# Altium schematic sheet REF_VOLTAGE_RELAY_DRIVER.SchDoc
size A; SheetNumber: 3; SheetTotal: 6
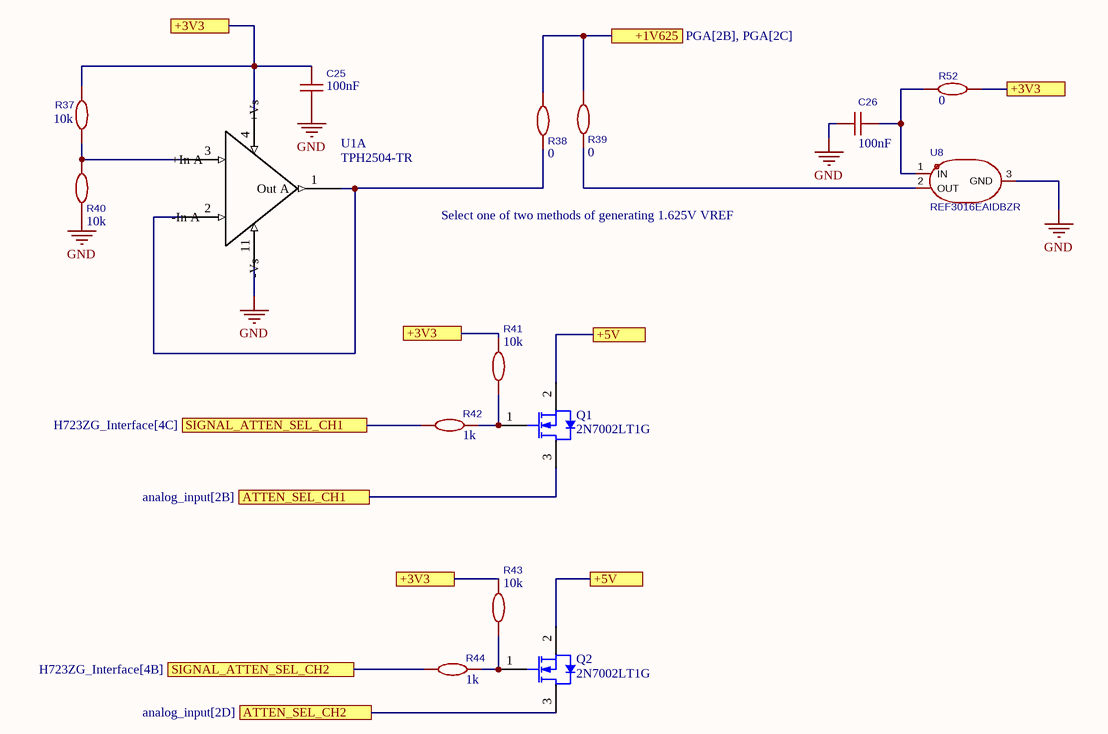
[diagram p0: REF_VOLTAGE_RELAY_DRIVER.SchDoc]

## Parts
C25  value 100nF  [C0805]  (hidden comment: 0805CG6R0C500NT_C67560)
C26  value 100nF  [C0805]  (hidden comment: 0805CG6R0C500NT_C67560)
Q1  2N7002LT1G  [ONSC-SOT-23-3-318-08_V]
Q2  2N7002LT1G  [ONSC-SOT-23-3-318-08_V]
R37  value 10k  [R0805]  (hidden comment: 0805W8F0000T5E_C17477)
R38  value 0  [R0805]  (hidden comment: 0805W8F0000T5E_C17477)
R39  value 0  [R0805]  (hidden comment: 0805W8F0000T5E_C17477)
R40  value 10k  [R0805]  (hidden comment: 0805W8F0000T5E_C17477)
R41  value 10k  [R0805]  (hidden comment: 0805W8F0000T5E_C17477)
R42  value 1k  [R0805]  (hidden comment: 0805W8F0000T5E_C17477)
R43  value 10k  [R0805]  (hidden comment: 0805W8F0000T5E_C17477)
R44  value 1k  [R0805]  (hidden comment: 0805W8F0000T5E_C17477)
R52  value 0  [R0805]  (hidden comment: 0805W8F0000T5E_C17477)
U1  TPH2504-TR  [TSOP65P640X120-14N]  (part A of 4)
U8  REF3016EAIDBZR  [SOT-23-3_L3.0-W1.7-P0.95-LS2.9-BR]

## Ports
+1V625 (see PGA[2B], PGA[2C]), +3V3 (see H723ZG_Interface[1A], PGA[2A], PGA[2B], PGA[4A], PGA[4C], REF_VOLTAGE_RELAY_DRIVER[1A], REF_VOLTAGE_RELAY_DRIVER[2B], REF_VOLTAGE_RELAY_DRIVER[2C], Trigger[1C], Trigger[3A]), +3V3 (see H723ZG_Interface[1A], PGA[2A], PGA[2B], PGA[4A], PGA[4C], REF_VOLTAGE_RELAY_DRIVER[1A], REF_VOLTAGE_RELAY_DRIVER[2B], REF_VOLTAGE_RELAY_DRIVER[4A], Trigger[1C], Trigger[3A]), +3V3 (see H723ZG_Interface[1A], PGA[2A], PGA[2B], PGA[4A], PGA[4C], REF_VOLTAGE_RELAY_DRIVER[1A], REF_VOLTAGE_RELAY_DRIVER[2C], REF_VOLTAGE_RELAY_DRIVER[4A], Trigger[1C], Trigger[3A]), +3V3 (see H723ZG_Interface[1A], PGA[2A], PGA[2B], PGA[4A], PGA[4C], REF_VOLTAGE_RELAY_DRIVER[2B], REF_VOLTAGE_RELAY_DRIVER[2C], REF_VOLTAGE_RELAY_DRIVER[4A], Trigger[1C], Trigger[3A]), +5V (see H723ZG_Interface[1A], PGA[3A], PGA[3C], REF_VOLTAGE_RELAY_DRIVER[2C], Trigger[2B], Trigger[4A]), +5V (see H723ZG_Interface[1A], PGA[3A], PGA[3C], REF_VOLTAGE_RELAY_DRIVER[3B], Trigger[2B], Trigger[4A]), ATTEN_SEL_CH1 (see analog_input[2B]), ATTEN_SEL_CH2 (see analog_input[2D]), SIGNAL_ATTEN_SEL_CH1 (see H723ZG_Interface[4C]), SIGNAL_ATTEN_SEL_CH2 (see H723ZG_Interface[4B])

## Nets
GND: C25.2 C26.1 R40.2 U1.11(-Vs) U8.3(GND)
+1V625: R38.1 R39.1 ; port +1V625
+3V3: C25.1 R37.1 R41.2 R43.2 R52.2 U1.4(+Vs) ; port +3V3
+5V: Q1.2(S) Q2.2(S) ; port +5V
ATTEN_SEL_CH1: Q1.3(D) ; port ATTEN_SEL_CH1
ATTEN_SEL_CH2: Q2.3(D) ; port ATTEN_SEL_CH2
SIGNAL_ATTEN_SEL_CH1: R42.1 ; port SIGNAL_ATTEN_SEL_CH1
SIGNAL_ATTEN_SEL_CH2: R44.1 ; port SIGNAL_ATTEN_SEL_CH2
NetC26_2: C26.2 R52.1 U8.1(IN)
NetQ1_1: Q1.1(G) R41.1 R42.2
NetQ2_1: Q2.1(G) R43.1 R44.2
NetR37_2: R37.2 R40.1 U1.3(+In_A)
NetR38_2: R38.2 U1.1(Out_A) U1.2(-In_A)
NetR39_2: R39.2 U8.2(OUT)

## Notes on the sheet
- Select one of two methods of generating 1.625V VREF

## Library data of the parts
C25 C26 = CMP-015-000003-2: Capacitance:100nF Tolerance:±5% Tolerance:±5% Voltage Rating:50V Temperature Coefficient:X7R; Manufacturer: YAGEO(国巨); AddInBom: yes; Device: CC0805JRX7R9BB104; ModelId: 8c88e81f49c6409b980720ec8953afb6聨0819f05c4eef4c71ace90d822a990e87; ModelName: C0805_L2.0-W1.3-H1.3; ModelTransform: 78.74,51.181,0,0,0,0,0,0.0005,0; Temperature Coefficient: X7R; Tolerance: 5%; Voltage Rating: 50V; ConvertToPcb: yes; Datasheet: https://item.szlcsc.com/datasheet/CC0805JRX7R9BB104/112720.html; Design Item ID: CC0805JRX7R9BB104; FootprintName: C0805; JLCPCB Part Class: Extended Part; LCSC Part Name: 100nF ±5% 50V; Source: P1.SCHLIB; Supplier Footprint: 0805; Symbol: CC0805JRX7R9BB104; Manufacturer Part Number: CC0805JRX7R9BB104; Supplier Part Number: C111492
Q1 Q2 = CMP-1058-00781-1: Small Signal MOSFET, 60 V, 115 mA, N-Channel, 3-Pin SOT-23, Pb-Free, Tape and Reel; Manufacturer: On Semiconductor; Channel Polarity: N Channel; V(BR)DSS Min (V): 60; ID Max (A): 0.115; VGS Max (V): 20; Configuration: Single; VGS(th) Max (V): 2.5; ComponentLink1URL: http://www.onsemi.com/; ComponentLink3Description: Package Specification; ComponentLink3URL: http://www.onsemi.cn/pub_link/Collateral/318-08.PDF; PackageReference: SOT-23-3-318-08; RoHS: Pb-Free; ComponentLink2URL: http://www.onsemi.com/pub_link/Collateral/2N7002L-D.PDF; ComponentLink1Description: Manufacturer URL; Package Type: SOT-23-3; Packing: Tape and Reel; PartNumber: 2N7002LT1G; DatasheetVersion: Rev. 7; Mounting Technology: Surface Mount; ComponentLink2Description: Datasheet; PackageDescription: 3-Pin Small Outline Transistor, Body 2.92 x 1.3 mm, Pitch 0.95 mm; PackageVersion: Rev. AP, 11/2009
R37 R40 R41 R43 = CMP-016-000002-1: Type:Thick Film Resistor Resistance:10kΩ Tolerance:±1% Tolerance:±1% Power(Watts):125mW Voltage-Supply(Max):150V Temperature Coefficient:±100ppm/℃ Temperature Coefficient:±100ppm/℃ Operating Temperature:-55℃~+155℃ Operating Temperature:-55℃~+155℃; Manufacturer: UNI-ROYAL(厚声); AddInBom: yes; Device: 0805W8F1002T5E; ModelId: b83c7c5430874b8eb2319a65d9433429聨0819f05c4eef4c71ace90d822a990e87; ModelName: R0805_L2.0-W1.3-H0.6; ModelTransform: 78.74,51.181,0,0,0,0,0,-0.0005,0; Power(Watts): 125mW; Tolerance: 1%; Voltage-Supply(Max): 150V; ConvertToPcb: yes; Datasheet: https://item.szlcsc.com/datasheet/0805W8F1002T5E/18102.html; Design Item ID: 0805W8F1002T5E; FootprintName: R0805; JLCPCB Part Class: Basic Part; LCSC Part Name: 10kΩ ±1% 125mW 厚膜电阻; Operating Temperature: -55℃~+155℃; Source: P1.SCHLIB; Supplier Footprint: 0805; Symbol: 0805W8F1002T5E; Temperature Coefficient: ±100ppm/℃; Type: Thick Film Resistor; Manufacturer Part Number: 0805W8F1002T5E; Supplier Part Number: C17414
R38 R39 R52 = CMP-016-000018-1: Type:Thick Film Resistor Resistance:0Ω Tolerance:±1% Tolerance:±1% Power(Watts):125mW Voltage-Supply(Max):150V Temperature Coefficient:±800ppm/℃ Temperature Coefficient:±800ppm/℃ Operating Temperature:-55℃~+155℃ Operating Temperature:-55℃~+155℃; Manufacturer: UNI-ROYAL(厚声); AddInBom: yes; ModelId: b83c7c5430874b8eb2319a65d9433429聨0819f05c4eef4c71ace90d822a990e87; ModelName: R0805_L2.0-W1.3-H0.6; ModelTransform: 78.74,51.181,0,0,0,0,0,-0.0005,0; Power(Watts): 125mW; Tolerance: 1%; Voltage-Supply(Max): 150V; ConvertToPcb: yes; Datasheet: https://item.szlcsc.com/datasheet/0805W8F0000T5E/18165.html; Design Item ID: 0805W8F0000T5E_C17477; Device: 0805W8F0000T5E_C17477; FootprintName: R0805; JLCPCB Part Class: Basic Part; LCSC Part Name: 0Ω ±1% 125mW 厚膜电阻; Operating Temperature: -55℃~+155℃; Source: P1.SCHLIB; Supplier Footprint: 0805; Symbol: 0805W8F0000T5E; Temperature Coefficient: ±800ppm/℃; Type: Thick Film Resistor; Manufacturer Part Number: 0805W8F0000T5E; Supplier Part Number: C17477
R42 R44 = CMP-016-000001-1: Type:Thick Film Resistors Resistance:1kΩ Tolerance:±1% Tolerance:±1% Power(Watts): Overload Voltage (Max): Temperature Coefficient:±100ppm/℃ Temperature Coefficient:±100ppm/℃ Operating Temperature Range:-55℃~+155℃ Operating Temperature Range:-55℃~+155℃; Manufacturer: UNI-ROYAL(厚声); AddInBom: yes; Device: 0805W8F1001T5E; ModelId: b83c7c5430874b8eb2319a65d9433429聨0819f05c4eef4c71ace90d822a990e87; ModelName: R0805_L2.0-W1.3-H0.6; ModelTransform: 78.74,51.181,0,0,0,0,0,-0.0005,0; Tolerance: 1%; ConvertToPcb: yes; Datasheet: https://atta.szlcsc.com/upload/public/pdf/source/20200306/C422600_1E6D84923E4A46A82E41ADD87F860B5C.pdf; Design Item ID: 0805W8F1001T5E; FootprintName: R0805; JLCPCB Part Class: Basic Part; LCSC Part Name: 1kΩ ±1% 125mW 厚膜电阻; Operating Temperature Range: -55℃~+155℃; Source: P1.SCHLIB; Supplier Footprint: 0805; Symbol: 0805W8F1001T5E; Temperature Coefficient: ±100ppm/℃; Type: Thick Film Resistors; Manufacturer Part Number: 0805W8F1001T5E; Supplier Part Number: C17513
U1 = CMP-00002-9: Operational Amplifier, 4 Func, 5000uV Offset-Max, CMOS, PDSO14; Max Supply Voltage: 7V; Number of Circuits: 4; Nominal Supply Voltage (DC): 3V; Input Offset Voltage (Vos): 5mV; Max Supply Current: 48mA; GAIN: 120Meg; Unity Gain Bandwidth Product: 120MHz; Common Mode Rejection Ratio: 45dB; Slew Rate: 160V/µs; Number of Terminals: 14; Terminal Pitch: 650µm; Max Operating Temperature: 125°C; Height - Seated (Max): 1.2mm; Length: 4.96mm; Min Operating Temperature: -40°C; RoHS: Compliant; Width: 4.4mm; Case/Package: TSSOP; Temperature Grade: Automotive
U8 = CMP-010-000000-2: Manufacturer: TI(德州仪器); AddInBom: yes; ModelTransform: 114.173,110.236,0,90,0,0,0,0,0; ModelName: SOT-23-3L_L2.9-W1.6-H1.1-LS2.8-P0.95; ModelId: 4eed685bb9f4439b846746bc2193f3c0ÂŽ0819f05c4eef4c71ace90d822a990e87; Device: REF3016EAIDBZR; Symbol: REF3016EAIDBZR; ConvertToPcb: yes; Supplier Footprint: SOT-23-3; FootprintName: SOT-23-3_L3.0-W1.7-P0.95-LS2.9-BR; JLCPCB Part Class: Extended Part; Source: schematic.SCHLIB; Design Item ID: REF3016EAIDBZR; LCSC Part Name: REF3016EAIDBZR; Manufacturer Part Number: REF3016EAIDBZR; Supplier Part Number: C54120489